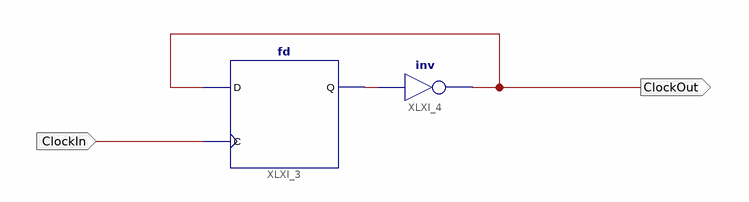
[diagram p0: schematic sheet 1]
// Xilinx ISE schematic ClockDivider_2.sch (spartan6) as structural Verilog: 2 symbols, 2 ports
module ClockDivider_2 (
  input  ClockIn,
  output ClockOut
);

  wire XLXN_2;

  fd XLXI_3 (.C(ClockIn), .D(ClockOut), .Q(XLXN_2));
  not XLXI_4 (ClockOut, XLXN_2);
endmodule
